# Altium schematic sheet Midi conector .SchDoc
size A
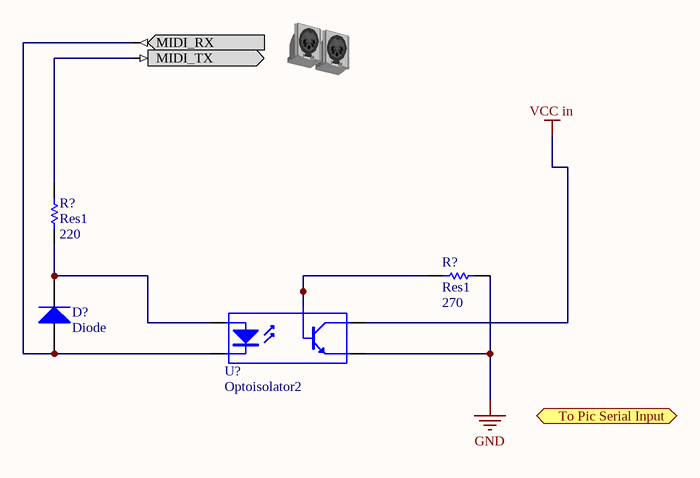
[diagram p0: Midi conector .SchDoc]

## Parts
(Parts that share a designator on the sheet are numbered #1, #2 ... from top to bottom, then left to right.)
?  MIDI  (value not drawn)
D?  Diode  [SMC]
R?#1  Res1  value 220  [AXIAL-0.3]
R?#2  Res1  value 270  [AXIAL-0.3]
U?  Optoisolator2  [SOP5(6)]

## Ports
To Pic Serial Input (out)

## Nets
GND: R?#2.1 U?.4(E)
VCC in: U?.5(C)
Net?_MIDI_RX: ?.MIDI_RX D?.1(A) U?.3(K)
Net?_MIDI_TX: ?.MIDI_TX R?#1.2
NetD?_2: D?.2(K) R?#1.1 U?.1(A)
NetR?#2_2: R?#2.2 U?.6(B)

## Library data of the parts
? = MIDI: MIDI Connector; RefFabricant: PSG03463; RefConstructeur: 1791756; Constructeur: PRO SIGNAL
D? = Diode: 1n914; Constructeur: FAIRCHILD SEMICONDUCTOR; RefConstructeur: 1N4454
R?#1 R?#2 = Res1: Resistor; Published: 8-Jun-2000; LatestRevisionDate: 17-Jul-2002; LatestRevisionNote: Re-released for DXP Platform.; PackageReference: AXIAL-0.3; Publisher: Altium Limited; PackageDescription: Axial Device, Thru-Hole; 2 Leads; 0.3 in Pin Spacing
U? = Optoisolator2: 5 Pin Mini Flat Pack Optocoupler; RefFabricant: 6N138; RefFournisseur: 1225822; Fournisseur: TOSHIBA